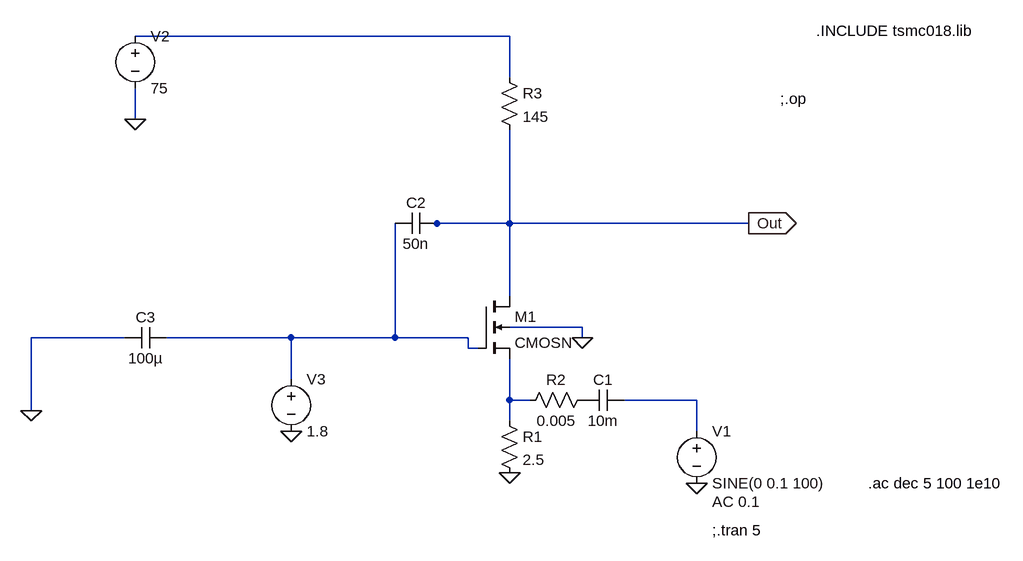
[diagram p0: schematic common gate amplifier.asc]
common gate amplifier.asc, the LTspice schematic file:
Version 4
SHEET 1 1004 680
WIRE 224 -304 -352 -304
WIRE 224 -240 224 -304
WIRE -352 -176 -352 -224
WIRE 112 -16 96 -16
WIRE 224 -16 224 -160
WIRE 224 -16 112 -16
WIRE 592 -16 224 -16
WIRE 224 96 224 -16
WIRE 336 144 224 144
WIRE -368 160 -512 160
WIRE -112 160 -304 160
WIRE 48 160 48 -16
WIRE 48 160 -112 160
WIRE 160 160 48 160
WIRE 336 160 336 144
WIRE 160 176 160 160
WIRE 176 176 160 176
WIRE -112 224 -112 160
WIRE 224 256 224 192
WIRE 256 256 224 256
WIRE 512 256 400 256
WIRE -512 272 -512 160
WIRE 224 288 224 256
WIRE 512 304 512 256
FLAG 336 160 0
FLAG 224 368 0
FLAG 512 384 0
FLAG 592 -16 Out
IOPIN 592 -16 Out
FLAG -512 272 0
FLAG -352 -176 0
FLAG -112 304 0
SYMBOL nmos4 176 96 R0
SYMATTR InstName M1
SYMATTR Value CMOSN
SYMATTR Value2 l=300n w=600u
SYMBOL res 208 272 R0
SYMATTR InstName R1
SYMATTR Value 2.5
SYMBOL cap 400 240 R90
WINDOW 0 0 32 VBottom 2
WINDOW 3 32 32 VTop 2
SYMATTR InstName C1
SYMATTR Value 10m
SYMBOL voltage 512 288 R0
WINDOW 123 24 124 Left 2
WINDOW 39 0 0 Left 0
SYMATTR InstName V1
SYMATTR Value SINE(0 0.1 100)
SYMATTR Value2 AC 0.1
SYMBOL res 208 -256 R0
SYMATTR InstName R3
SYMATTR Value 145
SYMBOL voltage -352 -320 R0
WINDOW 123 0 0 Left 0
WINDOW 39 0 0 Left 0
SYMATTR InstName V2
SYMATTR Value 75
SYMBOL cap -304 144 R90
WINDOW 0 0 32 VBottom 2
WINDOW 3 32 32 VTop 2
SYMATTR InstName C3
SYMATTR Value 100µ
SYMBOL voltage -112 208 R0
WINDOW 123 0 0 Left 0
WINDOW 39 0 0 Left 0
SYMATTR InstName V3
SYMATTR Value 1.8
SYMBOL res 352 240 R90
WINDOW 0 0 56 VBottom 2
WINDOW 3 32 56 VTop 2
SYMATTR InstName R2
SYMATTR Value 0.005
SYMBOL cap 112 -32 R90
WINDOW 0 0 32 VBottom 2
WINDOW 3 32 32 VTop 2
SYMATTR InstName C2
SYMATTR Value 50n
TEXT 640 -208 Left 2 !;.op
TEXT 536 456 Left 2 !;.tran 5
TEXT 696 -312 Left 2 !.INCLUDE tsmc018.lib
TEXT 776 384 Left 2 !.ac dec 5 100 1e10

The netlist it stands for:
* common gate amplifier.asc
M1 Out N002 N003 0 CMOSN l=300n w=600u
R1 N003 0 2.5
C1 N004 P001 10m
V1 N004 0 SINE(0 0.1 100) AC 0.1
R3 N001 Out 145
V2 N001 0 75
C3 N002 0 100µ
V3 N002 0 1.8
R2 P001 N003 0.005
C2 Out N002 50n
.model NMOS NMOS
.model PMOS PMOS
.lib standard.mos
;.op
;.tran 5
.INCLUDE tsmc018.lib
.ac dec 5 100 1e10
.backanno
.end